# Altium schematic sheet XT_NANO_DOCK.SchDoc
size A4
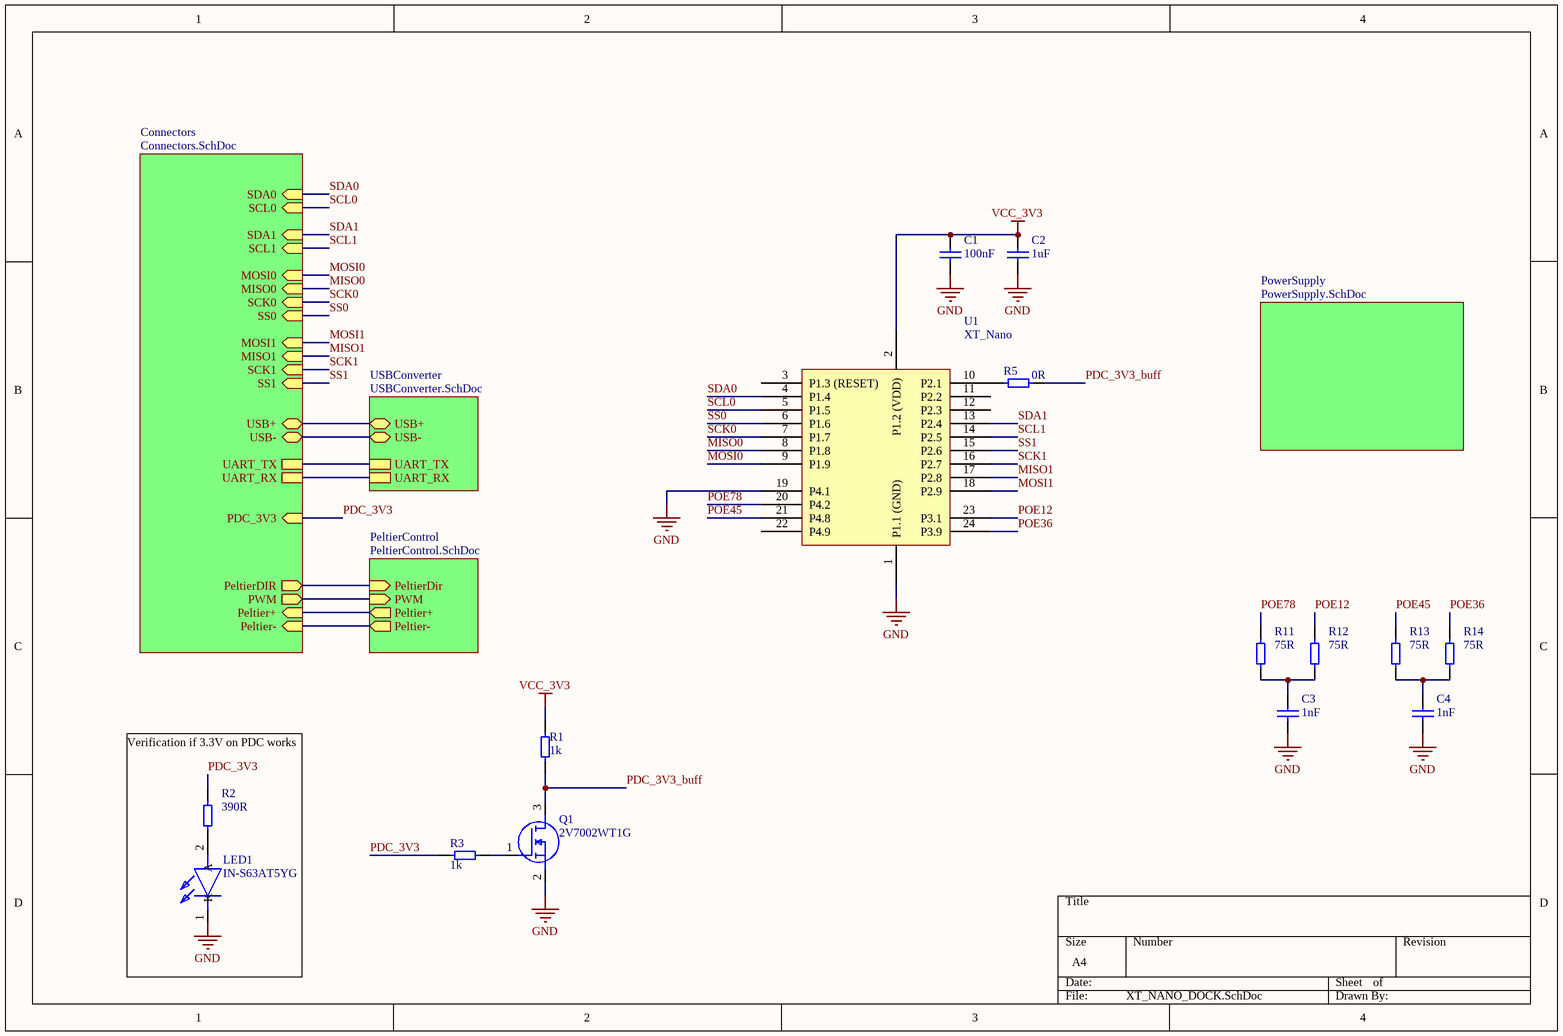
[diagram p0: XT_NANO_DOCK.SchDoc]

## Parts
C1  100nF  [0603-Capacitor]
C2  1uF  [0603-Capacitor]
C3  1nF  [0603-Capacitor]
C4  1nF  [0603-Capacitor]
LED1  IN-S63AT5YG  [LEDM168X39N]
Q1  2V7002WT1G  [SOT65P220X100-3N]
R1  1k  [0603-Resistor]
R2  390R  [0603-Resistor]
R3  1k  [0603-Resistor]
R5  0R  [0603-Resistor]
R11  75R  [0603-Resistor]
R12  75R  [0603-Resistor]
R13  75R  [0603-Resistor]
R14  75R  [0603-Resistor]
U1  XT_Nano  [XT-PICO]

## Sub-sheets
Connectors = Connectors.SchDoc: SDA0 (in), SCL0 (in), SDA1 (in), SCL1 (in), MISO0 (in), SCK0 (in), SS0 (in), MOSI0 (in), MISO1 (in), SCK1 (in), SS1 (in), MOSI1 (in), USB+ (bidir), USB- (bidir), PDC_3V3 (in), PeltierDIR (out), PWM (out), UART_TX, UART_RX, Peltier+ (in), Peltier- (in)
PeltierControl = PeltierControl.SchDoc: PWM (in), PeltierDir (in), Peltier+ (out), Peltier- (out)
PowerSupply = PowerSupply.SchDoc: no entries
USBConverter = USBConverter.SchDoc: USB- (bidir), USB+ (bidir), UART_TX, UART_RX

## Nets
GND: C1.2 C2.2 C3.2 C4.2 LED1.1(K) Q1.2(S) U1.1(P1.1_(GND)) U1.19(P4.1)
VCC_3V3: C1.1 C2.1 R1.1 U1.2(P1.2_(VDD))
MISO0: U1.8(P1.8) ; sheet Connectors/MISO0
MISO1: U1.17(P2.8) ; sheet Connectors/MISO1
MOSI0: U1.9(P1.9) ; sheet Connectors/MOSI0
MOSI1: U1.18(P2.9) ; sheet Connectors/MOSI1
PDC_3V3: R2.2 R3.2 ; sheet Connectors/PDC_3V3
PDC_3V3_buff: Q1.3(D) R1.2 R5.1
POE12: R12.2 U1.23(P3.1)
POE36: R14.2 U1.24(P3.9)
POE45: R13.2 U1.21(P4.8)
POE78: R11.2 U1.20(P4.2)
SCK0: U1.7(P1.7) ; sheet Connectors/SCK0
SCK1: U1.16(P2.7) ; sheet Connectors/SCK1
SCL0: U1.5(P1.5) ; sheet Connectors/SCL0
SCL1: U1.14(P2.5) ; sheet Connectors/SCL1
SDA0: U1.4(P1.4) ; sheet Connectors/SDA0
SDA1: U1.13(P2.4) ; sheet Connectors/SDA1
SS0: U1.6(P1.6) ; sheet Connectors/SS0
SS1: U1.15(P2.6) ; sheet Connectors/SS1
NetC3_1: C3.1 R11.1 R12.1
NetC4_1: C4.1 R13.1 R14.1
NetLED1_2: LED1.2(A) R2.1
NetQ1_1: Q1.1(G) R3.1
NetR5_2: R5.2 U1.10(P2.1)
(unnamed): sheet PeltierControl/PWM, sheet Connectors/PWM
(unnamed): sheet PeltierControl/PeltierDir, sheet Connectors/PeltierDIR
(unnamed): sheet PeltierControl/Peltier+, sheet Connectors/Peltier+
(unnamed): sheet PeltierControl/Peltier-, sheet Connectors/Peltier-
(unnamed): sheet Connectors/USB+, sheet USBConverter/USB+
(unnamed): sheet Connectors/USB-, sheet USBConverter/USB-
(unnamed): sheet Connectors/UART_TX, sheet USBConverter/UART_TX
(unnamed): sheet Connectors/UART_RX, sheet USBConverter/UART_RX

Not connected (* = marked no-connect by the designer): U1 3(P1.3_(RESET)) 11(P2.2) 12(P2.3) 22(P4.9)

## Notes on the sheet
- Verification if 3.3V on PDC works

## Library data of the parts
C1-C4 = C0603: Capacitor; Part Number: C0603; Pin Count: 2; Manufacturer: *; Package: 0603; ManufacturerNr: *; Voltage Rating: *; Dielectric: *
  C1: Value: 100nF
  C2: Value: 1uF
  C3 C4: Value: 1nF
LED1 = IN-S63AT5G: LED; Manufacturer_Name: Inolux; Datasheet Link: http://www.inolux-corp.com/datasheet/SMDLED/Mono%20Color%20Top%20View/IN-S63AT%20Series_V1.1.pdf; Height: 0.39mm; Manufacturer_Part_Number: IN-S63AT5YG; Mouser Part Number: 743-IN-S63AT5G; Mouser Price/Stock: https://www.mouser.com/Search/Refine.aspx?Keyword=743-IN-S63AT5G
Q1 = 2V7002WT1G: MOSFET (N-Channel); Manufacturer_Name: ON Semiconductor; Datasheet Link: http://www.onsemi.com/pub/Collateral/2N7002W-D.PDF; Height: 1mm; Manufacturer_Part_Number: 2V7002WT1G; Mouser Part Number: 863-2V7002WT1G; Mouser Price/Stock: https://www.mouser.com/Search/Refine.aspx?Keyword=863-2V7002WT1G; RS Part Number: 7905246P; RS Price/Stock: http://uk.rs-online.com/web/p/products/7905246P
R1 R3 R5 R11-R14 = R0603: Resistor; Part Number: R0603; Pin Count: 2; Manufacturer: *; Package: 0603; ManufacturerNr: *
  R1 R3: Value: 1k
  R5: Value: 0R
  R11-R14: Value: 75R
R2 = R0603: Resistor; Part Number: R0603; Value: 680R; Pin Count: 2; Manufacturer: *; Package: 0603; ManufacturerNr: *
U1 = XT_Nano: XT nano module by ak-nord; Manufacturer Nr: XT-NANO-SXL; Manufacturer: Ak-nord